# Altium schematic sheet main.SchDoc
size A4; SheetNumber: 1; SheetTotal: 4
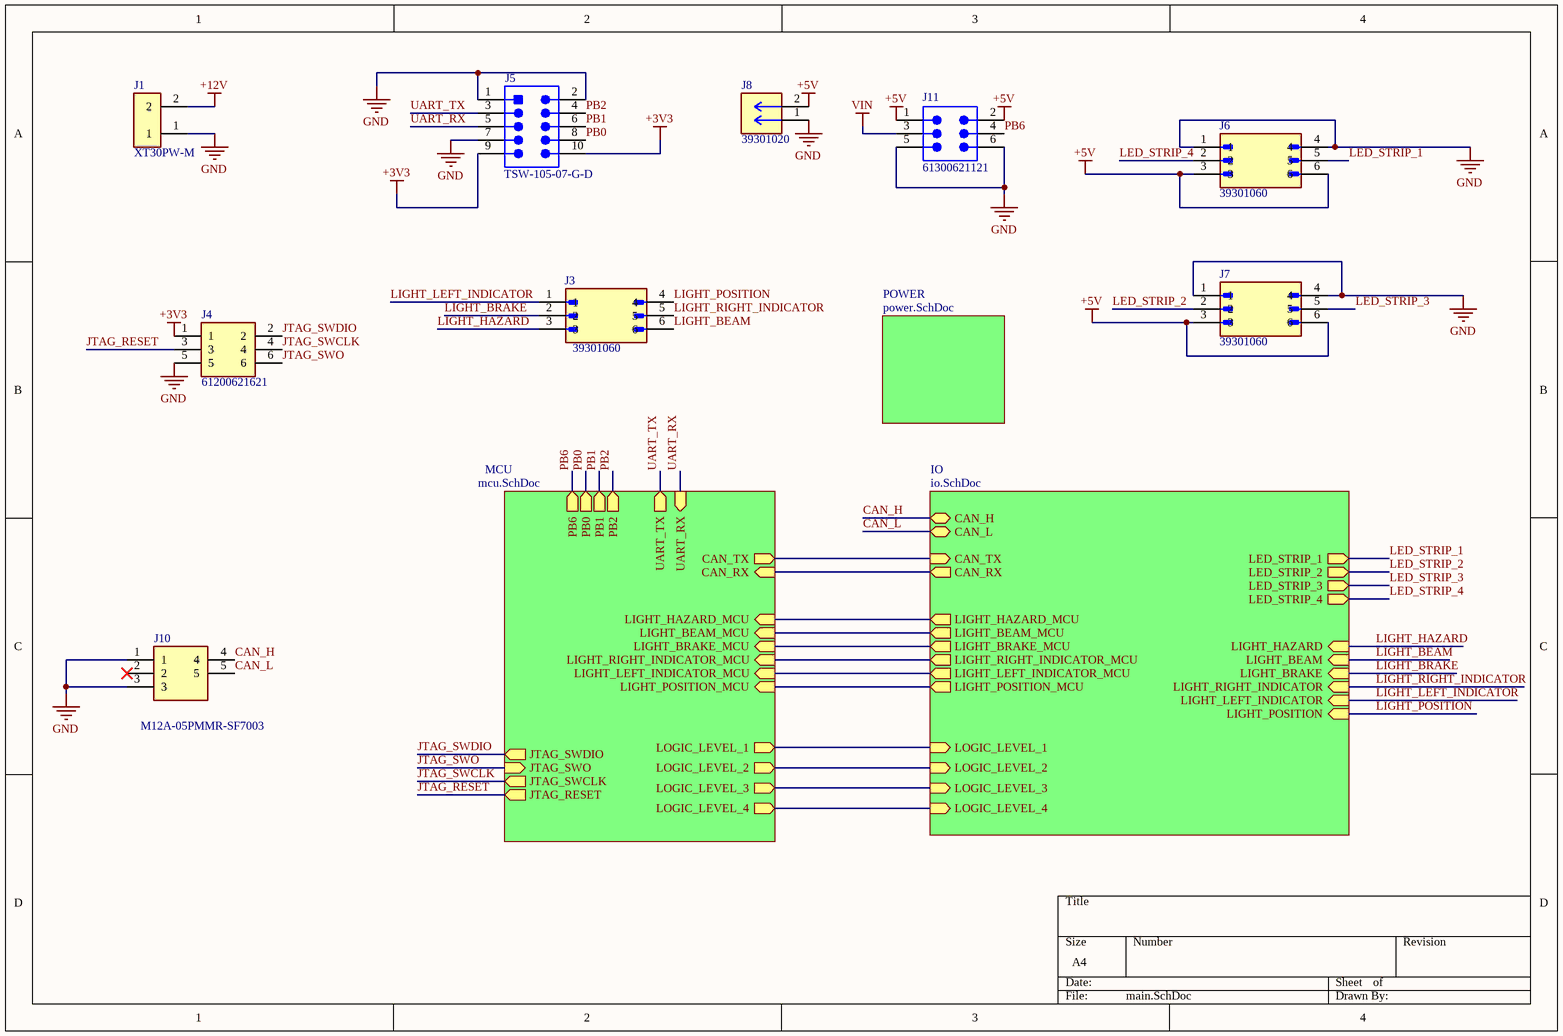
[diagram p0: main.SchDoc]

## Parts
J1  XT30PW-M  [XT30PWM]
J3  39301060  [39301060]
J4  61200621621  [61200621621]
J5  TSW-105-07-G-D  [SMTC-TSW-105-07-G-D_V]
J6  39301060  [39301060]
J7  39301060  [39301060]
J8  39301020  [39301020]
J10  M12A-05PMMR-SF7003  [M12A05PMMRSF7003]
J11  61300621121  [61300621121]

## Sub-sheets
IO = io.SchDoc: CAN_TX (in), CAN_RX (out), LED_STRIP_1 (out), LED_STRIP_2 (out), LED_STRIP_3 (out), LED_STRIP_4 (out), LOGIC_LEVEL_1 (in), LOGIC_LEVEL_2 (in), LOGIC_LEVEL_3 (in), LOGIC_LEVEL_4 (in), CAN_H (bidir), CAN_L (bidir), LIGHT_HAZARD_MCU (out), LIGHT_BEAM_MCU (out), LIGHT_BRAKE_MCU (out), LIGHT_RIGHT_INDICATOR_MCU (out), LIGHT_LEFT_INDICATOR_MCU (out), LIGHT_POSITION_MCU (out), LIGHT_HAZARD (in), LIGHT_BEAM (in), LIGHT_BRAKE (in), LIGHT_RIGHT_INDICATOR (in), LIGHT_LEFT_INDICATOR (in), LIGHT_POSITION (in)
MCU = mcu.SchDoc: CAN_TX (out), CAN_RX (in), UART_TX (out), UART_RX (in), LOGIC_LEVEL_1 (out), LOGIC_LEVEL_2 (out), LOGIC_LEVEL_3 (out), LOGIC_LEVEL_4 (out), JTAG_SWDIO (out), JTAG_SWO (in), JTAG_SWCLK (out), JTAG_RESET (out), LIGHT_HAZARD_MCU (in), LIGHT_BEAM_MCU (in), LIGHT_BRAKE_MCU (in), LIGHT_RIGHT_INDICATOR_MCU (in), LIGHT_LEFT_INDICATOR_MCU (in), LIGHT_POSITION_MCU (in), PB0 (out), PB1 (out), PB2 (out), PB6 (out)
POWER = power.SchDoc: no entries

## Nets
+3V3: J4.1 J5.9 J5.10
+5V: J6.3 J6.6 J7.3 J7.6 J8.2 J11.1 J11.2
+12V: J1.2
GND: J1.1 J4.5 J5.1 J5.2 J5.7 J6.1 J6.4 J7.1 J7.4 J8.1 J10.1 J10.3 J11.5 J11.6
VIN: J11.3
CAN_H: J10.4 ; sheet IO/CAN_H
CAN_L: J10.5 ; sheet IO/CAN_L
JTAG_RESET: J4.3 ; sheet MCU/JTAG_RESET
JTAG_SWCLK: J4.4 ; sheet MCU/JTAG_SWCLK
JTAG_SWDIO: J4.2 ; sheet MCU/JTAG_SWDIO
JTAG_SWO: J4.6 ; sheet MCU/JTAG_SWO
LED_STRIP_1: J6.5 ; sheet IO/LED_STRIP_1
LED_STRIP_2: J7.2 ; sheet IO/LED_STRIP_2
LED_STRIP_3: J7.5 ; sheet IO/LED_STRIP_3
LED_STRIP_4: J6.2 ; sheet IO/LED_STRIP_4
LIGHT_BEAM: J3.6 ; sheet IO/LIGHT_BEAM
LIGHT_BRAKE: J3.2 ; sheet IO/LIGHT_BRAKE
LIGHT_HAZARD: J3.3 ; sheet IO/LIGHT_HAZARD
LIGHT_LEFT_INDICATOR: J3.1 ; sheet IO/LIGHT_LEFT_INDICATOR
LIGHT_POSITION: J3.4 ; sheet IO/LIGHT_POSITION
LIGHT_RIGHT_INDICATOR: J3.5 ; sheet IO/LIGHT_RIGHT_INDICATOR
PB0: J5.8 ; sheet MCU/PB0
PB1: J5.6 ; sheet MCU/PB1
PB2: J5.4 ; sheet MCU/PB2
PB6: J11.4 ; sheet MCU/PB6
UART_RX: J5.5 ; sheet MCU/UART_RX
UART_TX: J5.3 ; sheet MCU/UART_TX
(unnamed): sheet MCU/CAN_TX, sheet IO/CAN_TX
(unnamed): sheet MCU/CAN_RX, sheet IO/CAN_RX
(unnamed): sheet MCU/LOGIC_LEVEL_1, sheet IO/LOGIC_LEVEL_1
(unnamed): sheet MCU/LOGIC_LEVEL_2, sheet IO/LOGIC_LEVEL_2
(unnamed): sheet MCU/LOGIC_LEVEL_3, sheet IO/LOGIC_LEVEL_3
(unnamed): sheet MCU/LOGIC_LEVEL_4, sheet IO/LOGIC_LEVEL_4
(unnamed): sheet MCU/LIGHT_HAZARD_MCU, sheet IO/LIGHT_HAZARD_MCU
(unnamed): sheet MCU/LIGHT_BEAM_MCU, sheet IO/LIGHT_BEAM_MCU
(unnamed): sheet MCU/LIGHT_BRAKE_MCU, sheet IO/LIGHT_BRAKE_MCU
(unnamed): sheet MCU/LIGHT_RIGHT_INDICATOR_MCU, sheet IO/LIGHT_RIGHT_INDICATOR_MCU
(unnamed): sheet MCU/LIGHT_LEFT_INDICATOR_MCU, sheet IO/LIGHT_LEFT_INDICATOR_MCU
(unnamed): sheet MCU/LIGHT_POSITION_MCU, sheet IO/LIGHT_POSITION_MCU

Not connected (* = marked no-connect by the designer): J10 2*

## Library data of the parts
J1 = XT30PW-M: Plug; XT30; Male; 30A; Low Temperature Rise Fire Retardant; Manufacturer_Name: Amass; Geometry.Height: 5mm; Manufacturer_Part_Number: XT30PW-M; Mouser Part Number: *; Mouser Price/Stock: *; Arrow Part Number: *; Arrow Price/Stock: *; Datasheet Link: https://www.tme.eu/sl/Document/ce4077e36b79046da520ca73227e15de/XT30PW%20SPEC.pdf; ComponentLink1URL: https://datasheet.octopart.com/XT30PW-M-Amass-datasheet-165556440.pdf?src-supplier=TME; ComponentLink1Description: https://datasheet.octopart.com/XT30PW-M-Amass-datasheet-165556440.pdf?src-supplier=TME
J3 J6 J7 = 39301060: Mini-Fit Jr. Through Hole PCB Header, Right Angle, 6 Contacts, 2 Rows, 4.2mm Pitch; Manufacturer: Molex; Manufacturer Lifecycle Status: ACTIVE; Approvals: CSA, TUV, UL; Connector Type: Power, Rectangular; Contact Resistance: 10mΩ; Current Rating: 8A; Gender: Male; Glow Wire Compliant: Non-compliant; Insulation Resistance: 1GΩ; Max Voltage Rating (AC): 600V; Number of Circuits: 4; Number of Contacts: 6; Number of Lines: 2; Plating Thickness: 2.54µm; Row Spacing: 5.5mm; Test Voltage: 1.5kV; Price: None; Value: *; Availability: Unavailable; MP: 39301060; Package: None; Supplier: RS; Supplier Part Number: 5109859P; Manufacturer Part Number: 39-30-1060; RoHS: Compliant; Category: Headers and Wire Housings; China RoHS: Compliant; Color: Natural; Contact Gender: Male; Contact Material: Brass; Contact Plating: Tin; Country of Origin: US; Depth: 12.8mm; ELV: Compliant; Flammability Rating: UL94 V-2; Halogen Free: Low Halogen; Height: 11.65mm; Housing Color: Natural; Housing Material: Nylon; Lead Free: Lead Free; Lead Pitch: 4.2mm; Length: 13.8mm; Lifecycle Status: Production; Material: Nylon; Max Current Rating: 8A; Max Operating Temperature: 105°C; Min Operating Temperature: -40°C; Mounting Technology: PCB, Through Hole; Pins: 6; Number of Poles: 6; Number of Positions: 6; Number of Rows: 1; Orientation: Right Angle, Vertical; Packaging: Bulk; Pitch: 4.2mm; Radiation Hardening: No; REACH SVHC: Yes; Schedule B: 8536694040, 8536694040|8536694040|8536694040|8536694040|8536694040|8536694040|8536694040|8536694040|8536694040|8536694040|8536694040|8536694040|8536694040|8536694040|8536694040|8536694040|8536694040|8536694040|8536694040|8536694040|8536694040|8536694040|8536694040|85; Termination: Solder; Voltage Rating: 600V; Voltage Rating (AC): 600V; Voltage Rating (DC): 600V; Working Voltage: 600V; ComponentLink1URL: https://datasheet.octopart.com:443/39-30-1060-Molex-datasheet-120074128.pdf?src-supplier=Farnell; ComponentLink1Description: https://datasheet.octopart.com:443/39-30-1060-Molex-datasheet-120074128.pdf?src-supplier=Farnell; ComponentLink2URL: https://datasheet.octopart.com:443/39-30-1060-Molex-datasheet-101582409.pdf?src-supplier=Farnell; ComponentLink2Description: https://datasheet.octopart.com:443/39-30-1060-Molex-datasheet-101582409.pdf?src-supplier=Farnell; ComponentLink3URL: https://datasheet.octopart.com:443/39-30-1060-Molex-datasheet-14359237.pdf?src-supplier=Farnell; ComponentLink3Description: https://datasheet.octopart.com:443/39-30-1060-Molex-datasheet-14359237.pdf?src-supplier=Farnell; ComponentLink4URL: https://datasheet.octopart.com:443/39-30-1060-Molex-datasheet-8451564.pdf?src-supplier=Farnell; ComponentLink4Description: https://datasheet.octopart.com:443/39-30-1060-Molex-datasheet-8451564.pdf?src-supplier=Farnell; ComponentLink5URL: https://datasheet.octopart.com:443/39-30-1060-Molex-datasheet-8377082.pdf?src-supplier=Farnell; ComponentLink5Description: https://datasheet.octopart.com:443/39-30-1060-Molex-datasheet-8377082.pdf?src-supplier=Farnell; ComponentLink6URL: https://datasheet.octopart.com:443/39-30-1060-Molex-datasheet-8338264.pdf?src-supplier=Farnell; ComponentLink6Description: https://datasheet.octopart.com:443/39-30-1060-Molex-datasheet-8338264.pdf?src-supplier=Farnell; ComponentLink7URL: https://datasheet.octopart.com:443/039301060-Molex-datasheet-8338717.pdf?src-supplier=Upverter; ComponentLink7Description: https://datasheet.octopart.com:443/039301060-Molex-datasheet-8338717.pdf?src-supplier=Upverter; ComponentLink8URL: https://datasheet.octopart.com:443/39-30-1060-Molex-datasheet-13785479.pdf?src-supplier=Sager+Electronics; ComponentLink8Description: https://datasheet.octopart.com:443/39-30-1060-Molex-datasheet-13785479.pdf?src-supplier=Sager+Electronics; ComponentLink9URL: https://sigma.octopart.com:443/15644801/technical_drawing/Molex-39-30-1060.pdf?src-supplier=Molex; ComponentLink9Description: https://sigma.octopart.com:443/15644801/technical_drawing/Molex-39-30-1060.pdf?src-supplier=Molex; ComponentLink10URL: https://datasheet.octopart.com:443/39-30-1060-Molex-datasheet-154749339.pdf?src-supplier=Master+Electronics; ComponentLink10Description: https://datasheet.octopart.com:443/39-30-1060-Molex-datasheet-154749339.pdf?src-supplier=Master+Electronics; ComponentLink11URL: https://datasheet.octopart.com:443/39-30-1060-Molex-datasheet-34205327.pdf?src-supplier=Electro+Sonic; ComponentLink11Description: https://datasheet.octopart.com:443/39-30-1060-Molex-datasheet-34205327.pdf?src-supplier=Electro+Sonic; ComponentLink12URL: https://datasheet.octopart.com:443/39-30-1060-Molex-datasheet-62104200.pdf?src-supplier=Electro+Sonic; ComponentLink12Description: https://datasheet.octopart.com:443/39-30-1060-Molex-datasheet-62104200.pdf?src-supplier=Electro+Sonic; ComponentLink13URL: https://datasheet.octopart.com:443/39-30-1060-Molex-datasheet-23709672.pdf?src-supplier=Electro+Sonic; ComponentLink13Description: https://datasheet.octopart.com:443/39-30-1060-Molex-datasheet-23709672.pdf?src-supplier=Electro+Sonic; ComponentLink14URL: https://datasheet.octopart.com:443/39-30-1060-Molex-datasheet-140183176.pdf?src-supplier=RS+(Formerly+Allied+Electronics); ComponentLink14Description: https://datasheet.octopart.com:443/39-30-1060-Molex-datasheet-140183176.pdf?src-supplier=RS+(Formerly+Allied+Electronics); ComponentLink15URL: https://datasheet.octopart.com:443/39-30-1060-Molex-datasheet-120148730.pdf?src-supplier=RS+(Formerly+Allied+Electronics); ComponentLink15Description: https://datasheet.octopart.com:443/39-30-1060-Molex-datasheet-120148730.pdf?src-supplier=RS+(Formerly+Allied+Electronics); ComponentLink16URL: https://datasheet.octopart.com:443/39-30-1060-Molex-datasheet-34442213.pdf?src-supplier=RS+(Formerly+Allied+Electronics); ComponentLink16Description: https://datasheet.octopart.com:443/39-30-1060-Molex-datasheet-34442213.pdf?src-supplier=RS+(Formerly+Allied+Electronics); ComponentLink17URL: https://datasheet.octopart.com:443/39-30-1060-Molex-datasheet-9719424.pdf?src-supplier=RS+(Formerly+Allied+Electronics); ComponentLink17Description: https://datasheet.octopart.com:443/39-30-1060-Molex-datasheet-9719424.pdf?src-supplier=RS+(Formerly+Allied+Electronics); ComponentLink18URL: https://datasheet.octopart.com:443/39-30-1060-Molex-datasheet-72655.pdf?src-supplier=RS+(Formerly+Allied+Electronics); ComponentLink18Description: https://datasheet.octopart.com:443/39-30-1060-Molex-datasheet-72655.pdf?src-supplier=RS+(Formerly+Allied+Electronics); ComponentLink19URL: https://datasheet.octopart.com:443/39-30-1060-Molex-datasheet-166013077.pdf?src-supplier=Jameco; ComponentLink19Description: https://datasheet.octopart.com:443/39-30-1060-Molex-datasheet-166013077.pdf?src-supplier=Jameco; ComponentLink20URL: https://datasheet.octopart.com:443/39301060-Molex-datasheet-8215776.pdf?src-supplier=Jameco; ComponentLink20Description: https://datasheet.octopart.com:443/39301060-Molex-datasheet-8215776.pdf?src-supplier=Jameco; ComponentLink21URL: https://datasheet.octopart.com:443/39-30-1060-Molex-datasheet-33002875.pdf?src-supplier=Newark; ComponentLink21Description: https://datasheet.octopart.com:443/39-30-1060-Molex-datasheet-33002875.pdf?src-supplier=Newark; ComponentLink22URL: https://datasheet.octopart.com:443/39-30-1060-Molex-datasheet-21207487.pdf?src-supplier=Newark; ComponentLink22Description: https://datasheet.octopart.com:443/39-30-1060-Molex-datasheet-21207487.pdf?src-supplier=Newark; ComponentLink23URL: https://datasheet.octopart.com:443/39-30-1060-Molex-datasheet-2405.pdf?src-supplier=Newark; ComponentLink23Description: https://datasheet.octopart.com:443/39-30-1060-Molex-datasheet-2405.pdf?src-supplier=Newark; ComponentLink24URL: https://datasheet.octopart.com:443/39-30-1060-Molex-datasheet-21395541.pdf?src-supplier=TME; ComponentLink24Description: https://datasheet.octopart.com:443/39-30-1060-Molex-datasheet-21395541.pdf?src-supplier=TME; ComponentLink25URL: https://datasheet.octopart.com:443/0039301060-Molex-datasheet-11554567.pdf?src-supplier=Arrow+Electronics; ComponentLink25Description: https://datasheet.octopart.com:443/0039301060-Molex-datasheet-11554567.pdf?src-supplier=Arrow+Electronics; ComponentLink26URL: https://datasheet.octopart.com:443/39-30-1060-Molex-datasheet-8361750.pdf?src-supplier=Verical; ComponentLink26Description: https://datasheet.octopart.com:443/39-30-1060-Molex-datasheet-8361750.pdf?src-supplier=Verical; ComponentLink27URL: https://datasheet.octopart.com:443/39-30-1060-Molex-datasheet-129274.pdf?src-supplier=DigiKey; ComponentLink27Description: https://datasheet.octopart.com:443/39-30-1060-Molex-datasheet-129274.pdf?src-supplier=DigiKey; ComponentLink28URL: http://sigma.octopart.com:80/15645378/rohs_certificate/Molex-39-30-1060.pdf?src-supplier=Compliance+Statements; ComponentLink28Description: http://sigma.octopart.com:80/15645378/rohs_certificate/Molex-39-30-1060.pdf?src-supplier=Compliance+Statements; ComponentLink29URL: http://sigma.octopart.com:80/conflict_mineral_statement/Molex-company-72.pdf?src-supplier=Compliance+Statements; ComponentLink29Description: http://sigma.octopart.com:80/conflict_mineral_statement/Molex-company-72.pdf?src-supplier=Compliance+Statements; ComponentLink30URL: http://sigma.octopart.com:80/rohs_statement/Molex-company-73.pdf?src-supplier=Compliance+Statements; ComponentLink30Description: http://sigma.octopart.com:80/rohs_statement/Molex-company-73.pdf?src-supplier=Compliance+Statements; ComponentLink31URL: http://sigma.octopart.com:80/reach_statement/Molex-company-74.pdf?src-supplier=Compliance+Statements; ComponentLink31Description: http://sigma.octopart.com:80/reach_statement/Molex-company-74.pdf?src-supplier=Compliance+Statements
  J3: Stock: 3490
  J6 J7: Stock: 3510
J4 = 61200621621: Conn Shrouded Header (4 Sides) M 6 POS 2.54mm Solder ST Top Entry Thru-Hole Tray; Manufacturer_Name: Wurth Elektronik; Geometry.Height: 9.1mm; Connector Type: Male Pin; Contact Resistance: 20mΩ; Current Rating: 3A; Gender: Male; Insulation Resistance: 1GΩ; Number of Contacts: 6; Operating Supply Voltage: 250V; Manufacturer_Part_Number: 61200621621; Mouser Part Number: 710-61200621621; Mouser Price/Stock: https://www.mouser.co.uk/ProductDetail/Wurth-Elektronik/61200621621?qs=PhR8RmCirEbjX8n1RKw4Jw%3D%3D; Arrow Part Number: *; Arrow Price/Stock: *; Datasheet Link: https://katalog.we-online.de/em/datasheet/6120xx21621.pdf; Supplier: RS; Supplier Part Number: 8236430; Manufacturer: Wurth Elektronik; Manufacturer Part Number: 61200621621; RoHS: Compliant; Category: Headers and Wire Housings; Stock: 450; Color: Black; Contact Material: Copper; Contact Plating: Gold; Insulation Material: PBT; Lead Pitch: 2.54mm; Length: 15.28mm; Max Operating Temperature: 105°C; Min Operating Temperature: -40°C; Mounting Technology: Through Hole; Pins: 6; Number of Positions: 6; Number of Rows: 2; Orientation: Vertical; Pitch: 2.54mm; Row Spacing: 2.54mm; Termination: Solder; ComponentLink1URL: https://datasheet.octopart.com:443/61200621621-Wurth-Elektronik-datasheet-168479915.pdf?src-supplier=Newark; ComponentLink1Description: https://datasheet.octopart.com:443/61200621621-Wurth-Elektronik-datasheet-168479915.pdf?src-supplier=Newark; ComponentLink2URL: https://datasheet.octopart.com:443/61200621621-W%C3%BCrth-Elektronik-datasheet-5367532.pdf?src-supplier=Newark; ComponentLink2Description: https://datasheet.octopart.com:443/61200621621-W%C3%BCrth-Elektronik-datasheet-5367532.pdf?src-supplier=Newark; ComponentLink3URL: https://datasheet.octopart.com:443/61200621621-W%C3%BCrth-Elektronik-datasheet-62127819.pdf?src-supplier=Upverter; ComponentLink3Description: https://datasheet.octopart.com:443/61200621621-W%C3%BCrth-Elektronik-datasheet-62127819.pdf?src-supplier=Upverter; ComponentLink4URL: https://datasheet.octopart.com:443/61200621621-W%C3%BCrth-Elektronik-datasheet-111087935.pdf?src-supplier=Wurth+Elektronik; ComponentLink4Description: https://datasheet.octopart.com:443/61200621621-W%C3%BCrth-Elektronik-datasheet-111087935.pdf?src-supplier=Wurth+Elektronik; ComponentLink5URL: https://datasheet.octopart.com:443/61200621621-W%C3%BCrth-Elektronik-datasheet-149523874.pdf?src-supplier=Farnell; ComponentLink5Description: https://datasheet.octopart.com:443/61200621621-W%C3%BCrth-Elektronik-datasheet-149523874.pdf?src-supplier=Farnell
J5 = CMP-2000-07330-1: Post Terminal Strip Assembly, Pitch 2.54 mm, 2 x 5 Position, Height 8.58 mm, Tail Length 2.54 mm, -55 to 125 degC, RoHS, Bulk; Manufacturer: Samtec-Inc.; Connector Type: Header,Unshrouded; Number of Positions Loaded: All; Pitch: 0.100"(2.54mm); Number of Positions: 10; Package Reference: TSW-105-07-G-D; Mounting Technology: ThroughHole; Datasheet URL: http://suddendocs.samtec.com/prints/tsw-xxx-xx-xxx-x-xx-xxx-mkt.pdf; Termination: Solder; Packaging: Bulk; Number of Rows: 2; Contact Finish: Gold; Mounting Type: ThroughHole; Features: -; Color: Black; Category: Connectors,Interconnects; Family: RectangularConnectors-Headers,MalePins; Manufacturer URL: http://www.samtec.com/; Series: TSW; Fastening Type: -; Package URL: http://suddendocs.samtec.com/prints/tsw-xxx-xx-x-x-xx-xxx-footprint.pdf; Row Spacing: 0.100"(2.54mm); Contact Mating Length: 0.230"(5.84mm); Contact Finish Thickness: 10µin(0.25µm); Contact Type: MalePin; Package Description: Male Header, Pitch 2.54 mm, 2 x 5 Position, Height 8.58 mm, Tail Length 2.54 mm; Datasheet Version: Rev. DO, 08/1988
J8 = 39301020: Pin Header, Power, 2 Rows, 2 Contacts, Through Hole Right Angle, Mini-Fit Jr. 5569; Manufacturer Lifecycle Status: ACTIVE; MF: Molex; Approvals: CSA, TUV, UL; Connector Type: Power, Rectangular; Contact Resistance: 10mΩ; Current Rating: 9A; Dielectric Material: Polyamide; Gender: Male; Glow Wire Compliant: Non-compliant; Insulation Resistance: 1GΩ; Number of Circuits: 2; Pitch: 4.2mm; Plating Thickness: 2.54µm; Voltage Rating: 600V; SnapEDA_Link: https://www.snapeda.com/parts/39301020/Molex/view-part/?ref=snap; Package: None; Value: *; MP: 39301020; Check_prices: https://www.snapeda.com/parts/39301020/Molex/view-part/?ref=eda; Supplier: RS; Supplier Part Number: 5109837P; Manufacturer: Molex; Manufacturer Part Number: 39-30-1020; RoHS: Compliant; Category: Headers and Wire Housings; Stock: 13288; China RoHS: Compliant; Color: Natural; Contact Gender: Male; Contact Material: Brass; Contact Plating: Tin; Country of Origin: US; Depth: 13.38mm; ELV: Compliant; Flammability Rating: UL94 V-2; Halogen Free: Low Halogen; Height: 14.76mm; Housing Material: Nylon; Lead Free: Lead Free; Lead Pitch: 4.2mm; Length: 36.07mm; Lifecycle Status: Production; Material: Nylon; Max Operating Temperature: 105°C; Min Operating Temperature: -40°C; Mounting Technology: PCB, Through Hole; Number of Contacts: 2; Pins: 2; Number of Poles: 2; Number of Positions: 2; Number of Rows: 2; Orientation: Right Angle; Radiation Hardening: No; REACH SVHC: Yes; Row Spacing: 4.2mm; Schedule B: 8536694040, 8536694040|8536694040, 8536694040|8536694040|8536694040, 8536694040|8536694040|8536694040|8536694040; Termination: Solder; Voltage Rating (AC): 600V; Voltage Rating (DC): 600V; Working Voltage: 600V; ComponentLink1URL: https://datasheet.octopart.com:443/39-30-1020-Molex-datasheet-120074128.pdf?src-supplier=IHS; ComponentLink1Description: https://datasheet.octopart.com:443/39-30-1020-Molex-datasheet-120074128.pdf?src-supplier=IHS; ComponentLink2URL: https://datasheet.octopart.com:443/039301020-Molex-datasheet-8338717.pdf?src-supplier=Upverter; ComponentLink2Description: https://datasheet.octopart.com:443/039301020-Molex-datasheet-8338717.pdf?src-supplier=Upverter; ComponentLink3URL: https://datasheet.octopart.com:443/39-30-1020-Molex-datasheet-13785309.pdf?src-supplier=Molex; ComponentLink3Description: https://datasheet.octopart.com:443/39-30-1020-Molex-datasheet-13785309.pdf?src-supplier=Molex; ComponentLink4URL: https://sigma.octopart.com:443/15644801/technical_drawing/Molex-39-30-1020.pdf?src-supplier=Molex; ComponentLink4Description: https://sigma.octopart.com:443/15644801/technical_drawing/Molex-39-30-1020.pdf?src-supplier=Molex; ComponentLink5URL: https://datasheet.octopart.com:443/39-30-1020-Molex-datasheet-36854730.pdf?src-supplier=Farnell; ComponentLink5Description: https://datasheet.octopart.com:443/39-30-1020-Molex-datasheet-36854730.pdf?src-supplier=Farnell; ComponentLink6URL: https://datasheet.octopart.com:443/39-30-1020-Molex-datasheet-101582405.pdf?src-supplier=Farnell; ComponentLink6Description: https://datasheet.octopart.com:443/39-30-1020-Molex-datasheet-101582405.pdf?src-supplier=Farnell; ComponentLink7URL: https://datasheet.octopart.com:443/39-30-1020-..-Molex-datasheet-81470918.pdf?src-supplier=Farnell; ComponentLink7Description: https://datasheet.octopart.com:443/39-30-1020-..-Molex-datasheet-81470918.pdf?src-supplier=Farnell; ComponentLink8URL: https://datasheet.octopart.com:443/39-30-1020-Molex-datasheet-14711183.pdf?src-supplier=Farnell; ComponentLink8Description: https://datasheet.octopart.com:443/39-30-1020-Molex-datasheet-14711183.pdf?src-supplier=Farnell; ComponentLink9URL: https://datasheet.octopart.com:443/39-30-1020-Molex-datasheet-10541087.pdf?src-supplier=Farnell; ComponentLink9Description: https://datasheet.octopart.com:443/39-30-1020-Molex-datasheet-10541087.pdf?src-supplier=Farnell; ComponentLink10URL: https://datasheet.octopart.com:443/39301020-Molex-datasheet-514359.pdf?src-supplier=Farnell; ComponentLink10Description: https://datasheet.octopart.com:443/39301020-Molex-datasheet-514359.pdf?src-supplier=Farnell; ComponentLink11URL: https://datasheet.octopart.com:443/39-30-1020-Molex-datasheet-154749331.pdf?src-supplier=Master+Electronics; ComponentLink11Description: https://datasheet.octopart.com:443/39-30-1020-Molex-datasheet-154749331.pdf?src-supplier=Master+Electronics; ComponentLink12URL: https://datasheet.octopart.com:443/39-30-1020-Molex-datasheet-21827347.pdf?src-supplier=Electro+Sonic; ComponentLink12Description: https://datasheet.octopart.com:443/39-30-1020-Molex-datasheet-21827347.pdf?src-supplier=Electro+Sonic; ComponentLink13URL: https://datasheet.octopart.com:443/39-30-1020-Molex-datasheet-62104194.pdf?src-supplier=Electro+Sonic; ComponentLink13Description: https://datasheet.octopart.com:443/39-30-1020-Molex-datasheet-62104194.pdf?src-supplier=Electro+Sonic; ComponentLink14URL: https://datasheet.octopart.com:443/39-30-1020-Molex-datasheet-140183168.pdf?src-supplier=RS+(Formerly+Allied+Electronics); ComponentLink14Description: https://datasheet.octopart.com:443/39-30-1020-Molex-datasheet-140183168.pdf?src-supplier=RS+(Formerly+Allied+Electronics); ComponentLink15URL: https://datasheet.octopart.com:443/39-30-1020-Molex-datasheet-120148721.pdf?src-supplier=RS+(Formerly+Allied+Electronics); ComponentLink15Description: https://datasheet.octopart.com:443/39-30-1020-Molex-datasheet-120148721.pdf?src-supplier=RS+(Formerly+Allied+Electronics); ComponentLink16URL: https://datasheet.octopart.com:443/39-30-1020-Molex-datasheet-34442213.pdf?src-supplier=RS+(Formerly+Allied+Electronics); ComponentLink16Description: https://datasheet.octopart.com:443/39-30-1020-Molex-datasheet-34442213.pdf?src-supplier=RS+(Formerly+Allied+Electronics); ComponentLink17URL: https://datasheet.octopart.com:443/39-30-1020-Molex-datasheet-9997016.pdf?src-supplier=RS+(Formerly+Allied+Electronics); ComponentLink17Description: https://datasheet.octopart.com:443/39-30-1020-Molex-datasheet-9997016.pdf?src-supplier=RS+(Formerly+Allied+Electronics); ComponentLink18URL: https://datasheet.octopart.com:443/39-30-1020-Molex-datasheet-46140.pdf?src-supplier=RS+(Formerly+Allied+Electronics); ComponentLink18Description: https://datasheet.octopart.com:443/39-30-1020-Molex-datasheet-46140.pdf?src-supplier=RS+(Formerly+Allied+Electronics); ComponentLink19URL: https://datasheet.octopart.com:443/39301020-Molex-datasheet-82994803.pdf?src-supplier=Newark; ComponentLink19Description: https://datasheet.octopart.com:443/39301020-Molex-datasheet-82994803.pdf?src-supplier=Newark; ComponentLink20URL: https://datasheet.octopart.com:443/39-30-1020-Molex-datasheet-33002868.pdf?src-supplier=Newark; ComponentLink20Description: https://datasheet.octopart.com:443/39-30-1020-Molex-datasheet-33002868.pdf?src-supplier=Newark; ComponentLink21URL: https://datasheet.octopart.com:443/39-30-1020-Molex-datasheet-21207481.pdf?src-supplier=Newark; ComponentLink21Description: https://datasheet.octopart.com:443/39-30-1020-Molex-datasheet-21207481.pdf?src-supplier=Newark; ComponentLink22URL: https://datasheet.octopart.com:443/39-30-1020-Molex-datasheet-2405.pdf?src-supplier=Newark; ComponentLink22Description: https://datasheet.octopart.com:443/39-30-1020-Molex-datasheet-2405.pdf?src-supplier=Newark; ComponentLink23URL: https://datasheet.octopart.com:443/39301020-Molex-datasheet-137316104.pdf?src-supplier=Future+Electronics; ComponentLink23Description: https://datasheet.octopart.com:443/39301020-Molex-datasheet-137316104.pdf?src-supplier=Future+Electronics; ComponentLink24URL: https://datasheet.octopart.com:443/39-30-1020-Molex-datasheet-21395541.pdf?src-supplier=TME; ComponentLink24Description: https://datasheet.octopart.com:443/39-30-1020-Molex-datasheet-21395541.pdf?src-supplier=TME; ComponentLink25URL: https://datasheet.octopart.com:443/39301020-Molex-datasheet-7600579.pdf?src-supplier=Jameco; ComponentLink25Description: https://datasheet.octopart.com:443/39301020-Molex-datasheet-7600579.pdf?src-supplier=Jameco; ComponentLink26URL: https://datasheet.octopart.com:443/39-30-1020-Molex-datasheet-46912895.pdf?src-supplier=Jameco; ComponentLink26Description: https://datasheet.octopart.com:443/39-30-1020-Molex-datasheet-46912895.pdf?src-supplier=Jameco; ComponentLink27URL: https://datasheet.octopart.com:443/39-30-1020-Molex-datasheet-131607.pdf?src-supplier=DigiKey; ComponentLink27Description: https://datasheet.octopart.com:443/39-30-1020-Molex-datasheet-131607.pdf?src-supplier=DigiKey; ComponentLink28URL: http://sigma.octopart.com:80/15645372/rohs_certificate/Molex-39-30-1020.pdf?src-supplier=Compliance+Statements; ComponentLink28Description: http://sigma.octopart.com:80/15645372/rohs_certificate/Molex-39-30-1020.pdf?src-supplier=Compliance+Statements; ComponentLink29URL: http://sigma.octopart.com:80/conflict_mineral_statement/Molex-company-72.pdf?src-supplier=Compliance+Statements; ComponentLink29Description: http://sigma.octopart.com:80/conflict_mineral_statement/Molex-company-72.pdf?src-supplier=Compliance+Statements; ComponentLink30URL: http://sigma.octopart.com:80/rohs_statement/Molex-company-73.pdf?src-supplier=Compliance+Statements; ComponentLink30Description: http://sigma.octopart.com:80/rohs_statement/Molex-company-73.pdf?src-supplier=Compliance+Statements; ComponentLink31URL: http://sigma.octopart.com:80/reach_statement/Molex-company-74.pdf?src-supplier=Compliance+Statements; ComponentLink31Description: http://sigma.octopart.com:80/reach_statement/Molex-company-74.pdf?src-supplier=Compliance+Statements
J10 = M12A-05PMMR-SF7003: M12, A Code, 4A, 05 pins, Male Contact, Hexagonal, M12*1.0, PCB 90ø, Front Fastened, IP67; Manufacturer_Name: Amphenol; Manufacturer: Amphenol LTW; Geometry.Height: 15mm; Connector Type: Signal; Number of Positions: 5; Voltage Rating: 60V; Manufacturer_Part_Number: M12A-05PMMR-SF7003; Mouser Part Number: 523-M12A05PMMRSF7003; Mouser Price/Stock: https://www.mouser.co.uk/ProductDetail/Amphenol-LTW/M12A-05PMMR-SF7003?qs=f9yNj16SXrIdWSE1H9dLLQ%3D%3D; Arrow Part Number: M12A-05PMMR-SF7003; Arrow Price/Stock: https://www.arrow.com/en/products/m12a-05pmmr-sf7003/amphenol?utm_currency=USD&region=nac; Datasheet Link: https://amphenolltw.com/down.php?prod_files=605433; Supplier: Avnet; Supplier Part Number: 50AC2957; Manufacturer Part Number: M12A-05PMMR-SF7003; RoHS: Compliant; Category: Circular Connectors; Stock: 32; Current Rating: 4A; Gender: Male; Lifecycle Status: Production; Pins: 5; ComponentLink1URL: https://datasheet.octopart.com:443/M12A-05PMMR-SF7003-Amphenol-datasheet-182346588.pdf?src-supplier=IHS; ComponentLink1Description: https://datasheet.octopart.com:443/M12A-05PMMR-SF7003-Amphenol-datasheet-182346588.pdf?src-supplier=IHS; ComponentLink2URL: https://datasheet.octopart.com:443/M12A-05PMMR-SF7003-Amphenol-LTW-datasheet-184719079.pdf?src-supplier=TME; ComponentLink2Description: https://datasheet.octopart.com:443/M12A-05PMMR-SF7003-Amphenol-LTW-datasheet-184719079.pdf?src-supplier=TME; ComponentLink3URL: https://datasheet.octopart.com:443/M12A-05PMMR-SF7003-Amphenol-LTW-datasheet-180194516.pdf?src-supplier=JRH+Electronics; ComponentLink3Description: https://datasheet.octopart.com:443/M12A-05PMMR-SF7003-Amphenol-LTW-datasheet-180194516.pdf?src-supplier=JRH+Electronics
J11 = CMP-1502-01072-3: NexarPartId: 32855529; Row Spacing: 2.54mm; Current Rating: 3A; Voltage Rating: 250V; Contact Resistance: 20mΩ; Connector Type: Male Pin; Number of Positions: 6; Gender: Male; Termination: Solder; Orientation: Vertical; Max Operating Temperature: 105°C; Contact Plating: Gold; Height: 8.89mm; Contact Mating Length: 5.9944mm; Mount: Through Hole; Min Operating Temperature: -40°C; Lead Pitch: 2.54mm; Number of Pins: 6; Operating Supply Voltage: 250V; Color: Black; Pitch: 2.54mm; Packaging: Bulk; Contact Material: Copper; REACH SVHC: Unknown; RoHS: Compliant; Number of Rows: 2; Number of Contacts: 6